# Altium project TP_Integrador_Palomino_Villafane_Manuel_R00.PrjPcb
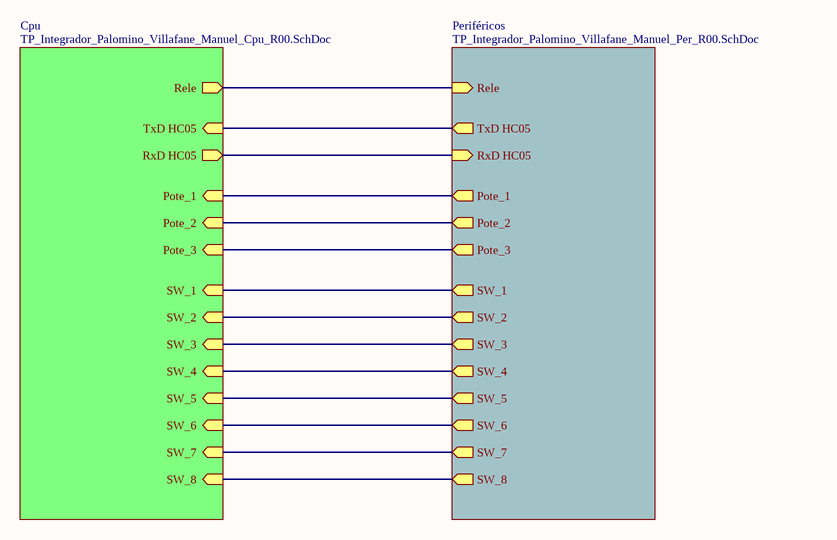
[diagram p0: TP_Integrador_Palomino_Villafane_Manuel_Blk_R00.SchDoc]
3 sheets, 31 parts. Net scope: hierarchical (ports join the sheet entries above them; power ports are global).
Board file: TP_Integrador_Palomino_Villafane_Manuel_R00.PcbDoc
Sheets:
  TP_Integrador_Palomino_Villafane_Manuel_Blk_R00.SchDoc
    Cpu = TP_Integrador_Palomino_Villafane_Manuel_Cpu_R00.SchDoc
    Periféricos = TP_Integrador_Palomino_Villafane_Manuel_Per_R00.SchDoc

## Sheet TP_Integrador_Palomino_Villafane_Manuel_Blk_R00.SchDoc
size A4; SheetNumber: 1; SheetTotal: 2

### Sub-sheets
Cpu = TP_Integrador_Palomino_Villafane_Manuel_Cpu_R00.SchDoc: RxD HC05 (out), TxD HC05 (in), Pote_1 (in), Rele (out), SW_2 (in), Pote_2 (in), Pote_3 (in), SW_3 (in), SW_4 (in), SW_5 (in), SW_6 (in), SW_7 (in), SW_8 (in), SW_1 (in)
Periféricos = TP_Integrador_Palomino_Villafane_Manuel_Per_R00.SchDoc: RxD HC05 (in), TxD HC05 (out), Rele (in), Pote_1 (out), Pote_2 (out), Pote_3 (out), SW_2 (out), SW_3 (out), SW_4 (out), SW_5 (out), SW_6 (out), SW_7 (out), SW_8 (out), SW_1 (out)

### Nets
Pote_1: sheet Cpu/Pote_1, sheet Periféricos/Pote_1
Pote_2: sheet Cpu/Pote_2, sheet Periféricos/Pote_2
Pote_3: sheet Cpu/Pote_3, sheet Periféricos/Pote_3
Rele: sheet Cpu/Rele, sheet Periféricos/Rele
RxD HC05: sheet Cpu/RxD HC05, sheet Periféricos/RxD HC05
SW_1: sheet Cpu/SW_1, sheet Periféricos/SW_1
SW_2: sheet Cpu/SW_2, sheet Periféricos/SW_2
SW_3: sheet Cpu/SW_3, sheet Periféricos/SW_3
SW_4: sheet Cpu/SW_4, sheet Periféricos/SW_4
SW_5: sheet Cpu/SW_5, sheet Periféricos/SW_5
SW_6: sheet Cpu/SW_6, sheet Periféricos/SW_6
SW_7: sheet Cpu/SW_7, sheet Periféricos/SW_7
SW_8: sheet Cpu/SW_8, sheet Periféricos/SW_8
TxD HC05: sheet Cpu/TxD HC05, sheet Periféricos/TxD HC05

## Sheet TP_Integrador_Palomino_Villafane_Manuel_Cpu_R00.SchDoc
size A4; SheetNumber: 2; SheetTotal: 3
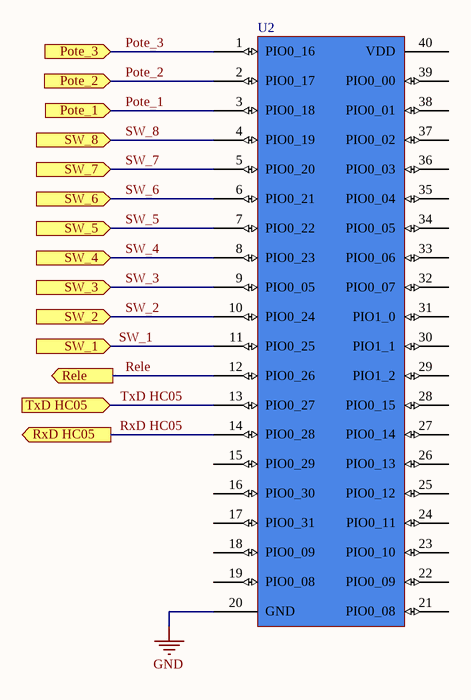
[diagram p1: TP_Integrador_Palomino_Villafane_Manuel_Cpu_R00.SchDoc]

### Parts
U2  Header F 1x20x.1"  x2  [LPC845_DIP40]  (value not drawn)

### Ports
Pote_1 (in, see TP_Integrador_Palomino_Villafane_Manuel_Blk_R00[2B], TP_Integrador_Palomino_Villafane_Manuel_Per_R00[4B]), Pote_2 (in, see TP_Integrador_Palomino_Villafane_Manuel_Blk_R00[2B], TP_Integrador_Palomino_Villafane_Manuel_Per_R00[4C]), Pote_3 (in, see TP_Integrador_Palomino_Villafane_Manuel_Blk_R00[2B], TP_Integrador_Palomino_Villafane_Manuel_Per_R00[4D]), Rele (out, see TP_Integrador_Palomino_Villafane_Manuel_Blk_R00[2B], TP_Integrador_Palomino_Villafane_Manuel_Per_R00[2A]), RxD HC05 (out, see TP_Integrador_Palomino_Villafane_Manuel_Blk_R00[2B], TP_Integrador_Palomino_Villafane_Manuel_Per_R00[4A]), SW_1 (in, see TP_Integrador_Palomino_Villafane_Manuel_Blk_R00[2B], TP_Integrador_Palomino_Villafane_Manuel_Per_R00[3C]), SW_2 (in, see TP_Integrador_Palomino_Villafane_Manuel_Blk_R00[2B], TP_Integrador_Palomino_Villafane_Manuel_Per_R00[2C]), SW_3 (in, see TP_Integrador_Palomino_Villafane_Manuel_Blk_R00[2C], TP_Integrador_Palomino_Villafane_Manuel_Per_R00[1C]), SW_4 (in, see TP_Integrador_Palomino_Villafane_Manuel_Blk_R00[2C], TP_Integrador_Palomino_Villafane_Manuel_Per_R00[1C]), SW_5 (in, see TP_Integrador_Palomino_Villafane_Manuel_Blk_R00[2C], TP_Integrador_Palomino_Villafane_Manuel_Per_R00[3C]), SW_6 (in, see TP_Integrador_Palomino_Villafane_Manuel_Blk_R00[2C], TP_Integrador_Palomino_Villafane_Manuel_Per_R00[2C]), SW_7 (in, see TP_Integrador_Palomino_Villafane_Manuel_Blk_R00[2C], TP_Integrador_Palomino_Villafane_Manuel_Per_R00[1C]), SW_8 (in, see TP_Integrador_Palomino_Villafane_Manuel_Blk_R00[2C], TP_Integrador_Palomino_Villafane_Manuel_Per_R00[1C]), TxD HC05 (in, see TP_Integrador_Palomino_Villafane_Manuel_Blk_R00[2B], TP_Integrador_Palomino_Villafane_Manuel_Per_R00[4A])

### Nets
GND: U2.20(GND)
Pote_1: U2.3(PIO0_18) ; port Pote_1
Pote_2: U2.2(PIO0_17) ; port Pote_2
Pote_3: U2.1(PIO0_16) ; port Pote_3
Rele: U2.12(PIO0_26) ; port Rele
RxD HC05: U2.14(PIO0_28) ; port RxD HC05
SW_1: U2.11(PIO0_25) ; port SW_1
SW_2: U2.10(PIO0_24) ; port SW_2
SW_3: U2.9(PIO0_05) ; port SW_3
SW_4: U2.8(PIO0_23) ; port SW_4
SW_5: U2.7(PIO0_22) ; port SW_5
SW_6: U2.6(PIO0_21) ; port SW_6
SW_7: U2.5(PIO0_20) ; port SW_7
SW_8: U2.4(PIO0_19) ; port SW_8
TxD HC05: U2.13(PIO0_27) ; port TxD HC05

Not connected (* = marked no-connect by the designer): U2 15(PIO0_29) 16(PIO0_30) 17(PIO0_31) 18(PIO0_09) 19(PIO0_08) 21(PIO0_08) 22(PIO0_09) 23(PIO0_10) 24(PIO0_11) 25(PIO0_12) 26(PIO0_13) 27(PIO0_14) 28(PIO0_15) 29(PIO1_2) 30(PIO1_1) 31(PIO1_0) 32(PIO0_07) 33(PIO0_06) 34(PIO0_05) 35(PIO0_04) 36(PIO0_03) 37(PIO0_02) 38(PIO0_01) 39(PIO0_00) 40(VDD)

### Library data of the parts
U2 = LPC845 Breakout board: Stick

## Sheet TP_Integrador_Palomino_Villafane_Manuel_Per_R00.SchDoc
size A4; SheetNumber: 3; SheetTotal: 3
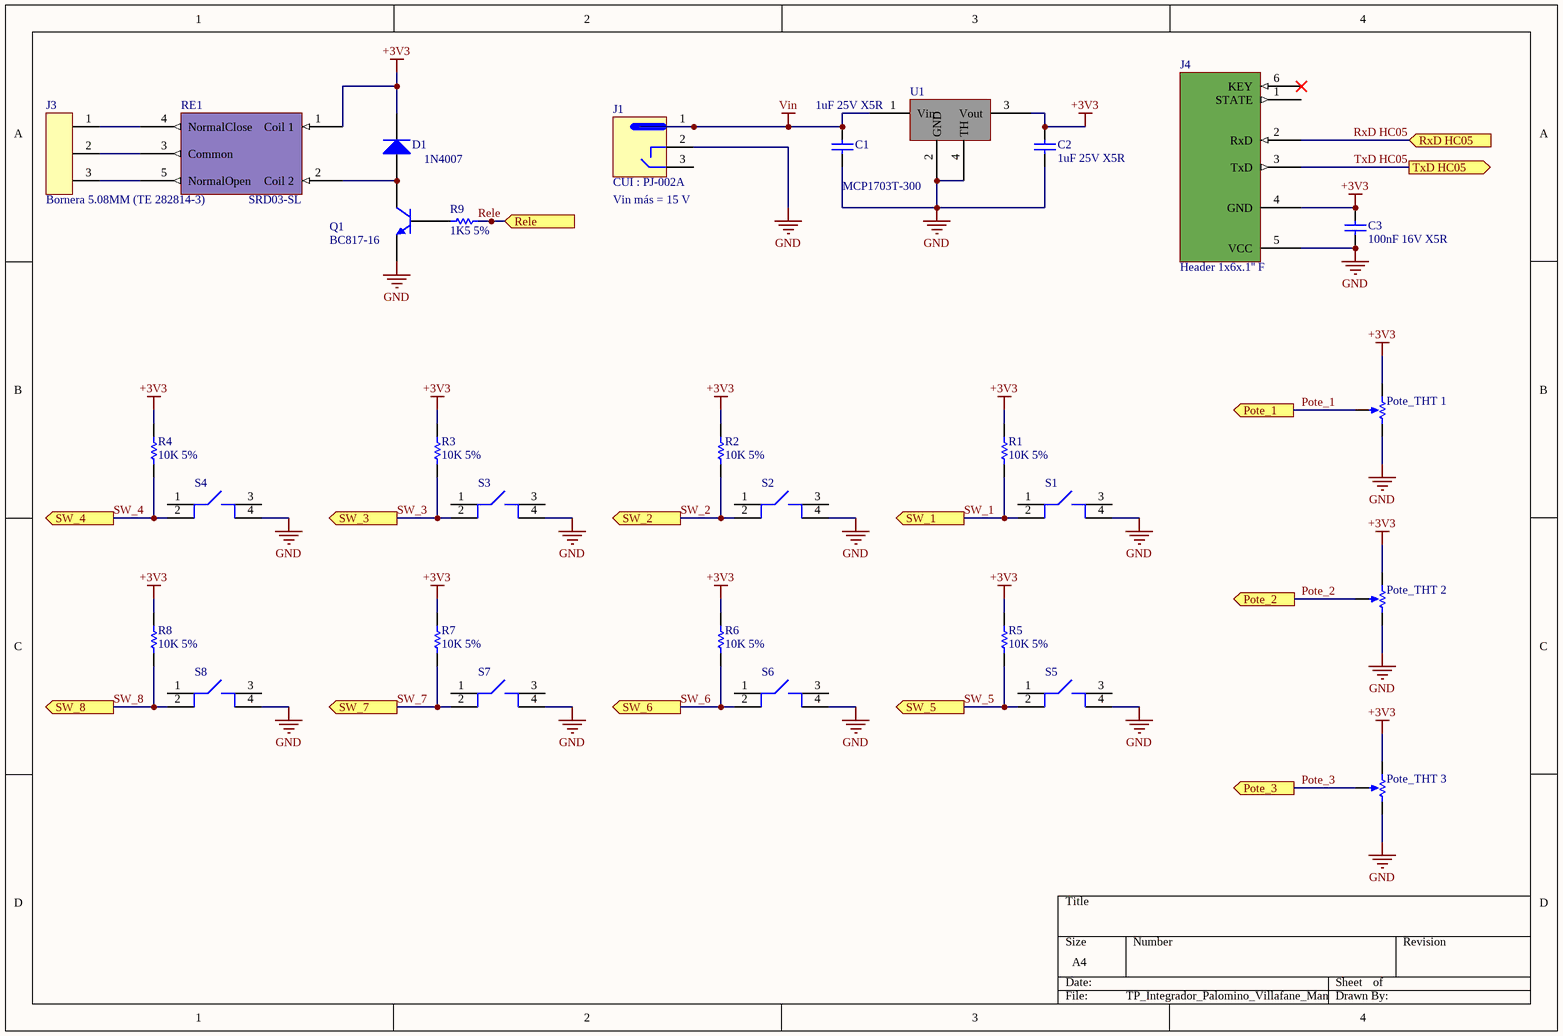
[diagram p2: TP_Integrador_Palomino_Villafane_Manuel_Per_R00.SchDoc]

### Parts
C1  1uF 25V X5R  [C_0805]
C2  1uF 25V X5R  [C_0805]
C3  100nF 16V X5R  [C_0805]
D1  1N4007  [SOD_123]
J1  CUI : PJ-002A  [PJ002B]
J3  Bornera 5.08MM (TE 282814-3)  [BORNERA-3X 5.08MM]
J4  Header 1x6x.1'' F  [HEADER F 1x6 .1" Horizintal]
Pote_THT_1  Potentiometer  [POTE_9.5MM_PTV09]  (value not drawn)
Pote_THT_2  Potentiometer  [POTE_9.5MM_PTV09]  (value not drawn)
Pote_THT_3  Potentiometer  [POTE_9.5MM_PTV09]  (value not drawn)
Q1  BC817-16  [SOT_23]
R1  value 10K 5%  [R_0805]  (hidden comment: 1K3 5%)
R2  value 10K 5%  [R_0805]  (hidden comment: 1K3 5%)
R3  value 10K 5%  [R_0805]  (hidden comment: 1K3 5%)
R4  value 10K 5%  [R_0805]  (hidden comment: 1K3 5%)
R5  value 10K 5%  [R_0805]  (hidden comment: 1K3 5%)
R6  value 10K 5%  [R_0805]  (hidden comment: 1K3 5%)
R7  value 10K 5%  [R_0805]  (hidden comment: 1K3 5%)
R8  value 10K 5%  [R_0805]  (hidden comment: 1K3 5%)
R9  Resistor  [R_0805]  (value not drawn)
RE1  SRD03-SL  [Relay SRD]
S1  Tact Switch - 430476085716  [Tact_Switch_12x12]  (value not drawn)
S2  Tact Switch - 430476085716  [Tact_Switch_12x12]  (value not drawn)
S3  Tact Switch - 430476085716  [Tact_Switch_12x12]  (value not drawn)
S4  Tact Switch - 430476085716  [Tact_Switch_12x12]  (value not drawn)
S5  Tact Switch - 430476085716  [Tact_Switch_12x12]  (value not drawn)
S6  Tact Switch - 430476085716  [Tact_Switch_12x12]  (value not drawn)
S7  Tact Switch - 430476085716  [Tact_Switch_12x12]  (value not drawn)
S8  Tact Switch - 430476085716  [Tact_Switch_12x12]  (value not drawn)
U1  MCP1703T-300  [SOT_223_4L]

### Ports
Pote_1 (out, see TP_Integrador_Palomino_Villafane_Manuel_Blk_R00[3B], TP_Integrador_Palomino_Villafane_Manuel_Cpu_R00[2B]), Pote_2 (out, see TP_Integrador_Palomino_Villafane_Manuel_Blk_R00[3B], TP_Integrador_Palomino_Villafane_Manuel_Cpu_R00[2B]), Pote_3 (out, see TP_Integrador_Palomino_Villafane_Manuel_Blk_R00[3B], TP_Integrador_Palomino_Villafane_Manuel_Cpu_R00[2B]), Rele (in, see TP_Integrador_Palomino_Villafane_Manuel_Blk_R00[3B], TP_Integrador_Palomino_Villafane_Manuel_Cpu_R00[3C]), RxD HC05 (in, see TP_Integrador_Palomino_Villafane_Manuel_Blk_R00[3B], TP_Integrador_Palomino_Villafane_Manuel_Cpu_R00[2C]), SW_1 (out, see TP_Integrador_Palomino_Villafane_Manuel_Blk_R00[3B], TP_Integrador_Palomino_Villafane_Manuel_Cpu_R00[2C]), SW_2 (out, see TP_Integrador_Palomino_Villafane_Manuel_Blk_R00[3B], TP_Integrador_Palomino_Villafane_Manuel_Cpu_R00[2C]), SW_3 (out, see TP_Integrador_Palomino_Villafane_Manuel_Blk_R00[3C], TP_Integrador_Palomino_Villafane_Manuel_Cpu_R00[2B]), SW_4 (out, see TP_Integrador_Palomino_Villafane_Manuel_Blk_R00[3C], TP_Integrador_Palomino_Villafane_Manuel_Cpu_R00[2B]), SW_5 (out, see TP_Integrador_Palomino_Villafane_Manuel_Blk_R00[3C], TP_Integrador_Palomino_Villafane_Manuel_Cpu_R00[2B]), SW_6 (out, see TP_Integrador_Palomino_Villafane_Manuel_Blk_R00[3C], TP_Integrador_Palomino_Villafane_Manuel_Cpu_R00[2B]), SW_7 (out, see TP_Integrador_Palomino_Villafane_Manuel_Blk_R00[3C], TP_Integrador_Palomino_Villafane_Manuel_Cpu_R00[2B]), SW_8 (out, see TP_Integrador_Palomino_Villafane_Manuel_Blk_R00[3C], TP_Integrador_Palomino_Villafane_Manuel_Cpu_R00[2B]), TxD HC05 (out, see TP_Integrador_Palomino_Villafane_Manuel_Blk_R00[3B], TP_Integrador_Palomino_Villafane_Manuel_Cpu_R00[2C])

### Nets
+3V3: C2.2 C3.2 D1.2(K) J4.4(GND) Pote_THT_1.1(TOP) Pote_THT_2.1(TOP) Pote_THT_3.1(TOP) R1.2 R2.2 R3.2 R4.2 R5.2 R6.2 R7.2 R8.2 RE1.1(Coil_1) U1.3(Vout)
GND: C1.1 C2.1 C3.1 J1.2 J4.5(VCC) Pote_THT_1.2(BOT) Pote_THT_2.2(BOT) Pote_THT_3.2(BOT) Q1.2(E) S1.4 S2.4 S3.4 S4.4 S5.4 S6.4 S7.4 S8.4 U1.2(GND) U1.4(TH)
Vin: C1.2 J1.1 U1.1(Vin)
Pote_1: Pote_THT_1.3(TAP) ; port Pote_1
Pote_2: Pote_THT_2.3(TAP) ; port Pote_2
Pote_3: Pote_THT_3.3(TAP) ; port Pote_3
Rele: R9.2 ; port Rele
RxD HC05: J4.2(RxD) ; port RxD HC05
SW_1: R1.1 S1.2 ; port SW_1
SW_2: R2.1 S2.2 ; port SW_2
SW_3: R3.1 S3.2 ; port SW_3
SW_4: R4.1 S4.2 ; port SW_4
SW_5: R5.1 S5.2 ; port SW_5
SW_6: R6.1 S6.2 ; port SW_6
SW_7: R7.1 S7.2 ; port SW_7
SW_8: R8.1 S8.2 ; port SW_8
TxD HC05: J4.3(TxD) ; port TxD HC05
NetD1_1: D1.1(A) Q1.3(C) RE1.2(Coil_2)
NetJ3_1: J3.1 RE1.4(NormalClose)
NetJ3_2: J3.2 RE1.3(Common)
NetJ3_3: J3.3 RE1.5(NormalOpen)
NetQ1_1: Q1.1(B) R9.1

Not connected (* = marked no-connect by the designer): J1 3; J4 1(STATE) 6(KEY)*; S1 1 3; S2 1 3; S3 1 3; S4 1 3; S5 1 3; S6 1 3; S7 1 3; S8 1 3

### Notes on the sheet
- (near J1) Vin más = 15 V

### Library data of the parts
C1-C3 = Capacitor: SimulationGenericComponent: True
  C1 C2: Value: 1uF 25V X5R
  C3: Value: 100nF 16V X5R
D1 = Diode: AF: 1; BV: 0; BV_MAX: 1e99; EG: 1.11; FC: 0.5; IBV: 0.001; ISR: 1e-14; MJSW: 0.33; NTUN: 30; TNOM: 27; XTI: 3; SimulationGenericComponent: True; CJO: 0; CJP: 0; CTA: 0; CTP: 0; FCS: 0.5; FV_MAX: 1e99; IKF: 0; IKR: 0; JSW: 0; JTUN: 0; JTUNSW: 0; KEG: 1; KF: 0; LEVEL: 1; N: 1; NBV: 1; NR: 1; NS: 1; PHP: 1; RS: 0; TCV: 0; TLEV: 0; TLEVC: 0; TM1: 0; TM2: 0; TPB: 0; TPHP: 0; TRS: 0; TRS2: 0; TT: 0; TTT1: 0; TTT2: 0; VJ: 1; XTITUN: 3; IS: 1e-14
J1 = PowerInput: DC Power Jack
J3 = Header 1x3: Header
J4 = HC05: Bluetooth
Pote_THT_1-Pote_THT_3 = Potentiometer: value: 1k; position: 0.5; SimulationGenericComponent: True
Q1 = BJT NPN VBIC: Bipolar NPN 3 Pins Transistor VBIC Model; SimulationGenericComponent: True; AFN: 1; AJC: -0.5; ART: 0.1; AVC1: 0; EA: 1.12; FC: 0.9; IBBE: 1e-06; IBCI: 1e-16; IBEI: 1e-18; MC: 0.33; NCN: 2; NKF: 0.5; PC: 0.75; TNOM: 27; VERS: 1.2; XII: 3; AJE: -0.5; AJS: -0.5; AVC2: 0; BFN: 1; CBCO: 0; CBEO: 0; CCSO: 0; CJC: 0; CJCP: 0; CJE: 0; CJEP: 0; CTH: 0; DEAR: 0; EAIC: 1.12; EAIE: 1.12; EAIS: 1.12; EANC: 1.12; EANE: 1.12; EANS: 1.12; EAP: 1.12; EBBE: 0; GAMM: 0; HRCF: 1; IBCIP: 0; IBCN: 0; IBCNP: 0; IBEIP: 0; IBEN: 0; IBENP: 0; IKF: 0; IKP: 0; IKR: 0; IS: 1e-16; ISP: 0; ISRR: 1; ITF: 0; KFN: 0; ME: 0.33; MS: 0.33; NBBE: 1; NCI: 1; NCIP: 1; NCNP: 2; NEI: 1; NEN: 2; NF: 1; NFP: 1; NR: 1; PE: 0.75; PS: 0.75; QBM: 0; QCO: 0; QTF: 0; RBI: 0.1; RBP: 0.1; RBX: 0; RCI: 0.1; RCX: 0; RE: 0; RS: 0; RTH: 0; TAVC: 0; TD: 0; TF: 0; TNBBE: 0; TNF: 0; TR: 0; TVBBE1: 0; TVBBE2: 0; VBBE: 0; VEF: 0; VER: 0; VO: 0; VREF: 0; VRT: 0; VTF: 0; WBE: 1; WSP: 1; XIKF: 0; XIN: 3; XIS: 3; XISR: 0; XRBI: 0; XRBP: 0; XRBX: 0; XRCI: 0; XRCX: 0; XRE: 0; XRS: 0; XTF: 0; XVO: 0
R1-R9 = Resistor: TC1: 0; SimulationGenericComponent: True; TC2: 0
  R9: 1K5 5%: 1K5 5%
RE1 = RELAY
S1-S8 = TactSwitch: Tact Switch
U1 = MCP1703: LDO

## Nets that join several sheets
GND: TP_Integrador_Palomino_Villafane_Manuel_Cpu_R00 (U2.20), TP_Integrador_Palomino_Villafane_Manuel_Per_R00 (19 pins)
Pote_1: TP_Integrador_Palomino_Villafane_Manuel_Cpu_R00 (U2.3), TP_Integrador_Palomino_Villafane_Manuel_Per_R00 (Pote_THT_1.3)
Pote_2: TP_Integrador_Palomino_Villafane_Manuel_Cpu_R00 (U2.2), TP_Integrador_Palomino_Villafane_Manuel_Per_R00 (Pote_THT_2.3)
Pote_3: TP_Integrador_Palomino_Villafane_Manuel_Cpu_R00 (U2.1), TP_Integrador_Palomino_Villafane_Manuel_Per_R00 (Pote_THT_3.3)
Rele: TP_Integrador_Palomino_Villafane_Manuel_Cpu_R00 (U2.12), TP_Integrador_Palomino_Villafane_Manuel_Per_R00 (R9.2)
RxD HC05: TP_Integrador_Palomino_Villafane_Manuel_Cpu_R00 (U2.14), TP_Integrador_Palomino_Villafane_Manuel_Per_R00 (J4.2)
SW_1: TP_Integrador_Palomino_Villafane_Manuel_Cpu_R00 (U2.11), TP_Integrador_Palomino_Villafane_Manuel_Per_R00 (R1.1 S1.2)
SW_2: TP_Integrador_Palomino_Villafane_Manuel_Cpu_R00 (U2.10), TP_Integrador_Palomino_Villafane_Manuel_Per_R00 (R2.1 S2.2)
SW_3: TP_Integrador_Palomino_Villafane_Manuel_Cpu_R00 (U2.9), TP_Integrador_Palomino_Villafane_Manuel_Per_R00 (R3.1 S3.2)
SW_4: TP_Integrador_Palomino_Villafane_Manuel_Cpu_R00 (U2.8), TP_Integrador_Palomino_Villafane_Manuel_Per_R00 (R4.1 S4.2)
SW_5: TP_Integrador_Palomino_Villafane_Manuel_Cpu_R00 (U2.7), TP_Integrador_Palomino_Villafane_Manuel_Per_R00 (R5.1 S5.2)
SW_6: TP_Integrador_Palomino_Villafane_Manuel_Cpu_R00 (U2.6), TP_Integrador_Palomino_Villafane_Manuel_Per_R00 (R6.1 S6.2)
SW_7: TP_Integrador_Palomino_Villafane_Manuel_Cpu_R00 (U2.5), TP_Integrador_Palomino_Villafane_Manuel_Per_R00 (R7.1 S7.2)
SW_8: TP_Integrador_Palomino_Villafane_Manuel_Cpu_R00 (U2.4), TP_Integrador_Palomino_Villafane_Manuel_Per_R00 (R8.1 S8.2)
TxD HC05: TP_Integrador_Palomino_Villafane_Manuel_Cpu_R00 (U2.13), TP_Integrador_Palomino_Villafane_Manuel_Per_R00 (J4.3)